# Altium project BerndoKeyboard-Switchboard.PrjPcb (part 2 of 4)

## Sheet [03] - Keyboard Matrix 1.SchDoc: Keyboard Matrix 1
size A3; Date: N.A.; ApprovedBy: N.A.; CheckedBy: N.A.; Author: N.A.; CompanyName: Johannes Berndorfer; DrawnBy: JBE; Organization: N.A.; Address1: Konrad Grefe Gasse 22; Address2: 1230 Wien; Address3: AUSTRIA; Address4: N.A.; DocumentNumber: 3; Revision: A; SheetNumber: 3; SheetTotal: 8; ProjectTitle: Berndo Keyboard Switchboard PCB; Reviewer: -; Time: N.A.; ImagePath: N.A.; Application_BuildNumber: N.A.
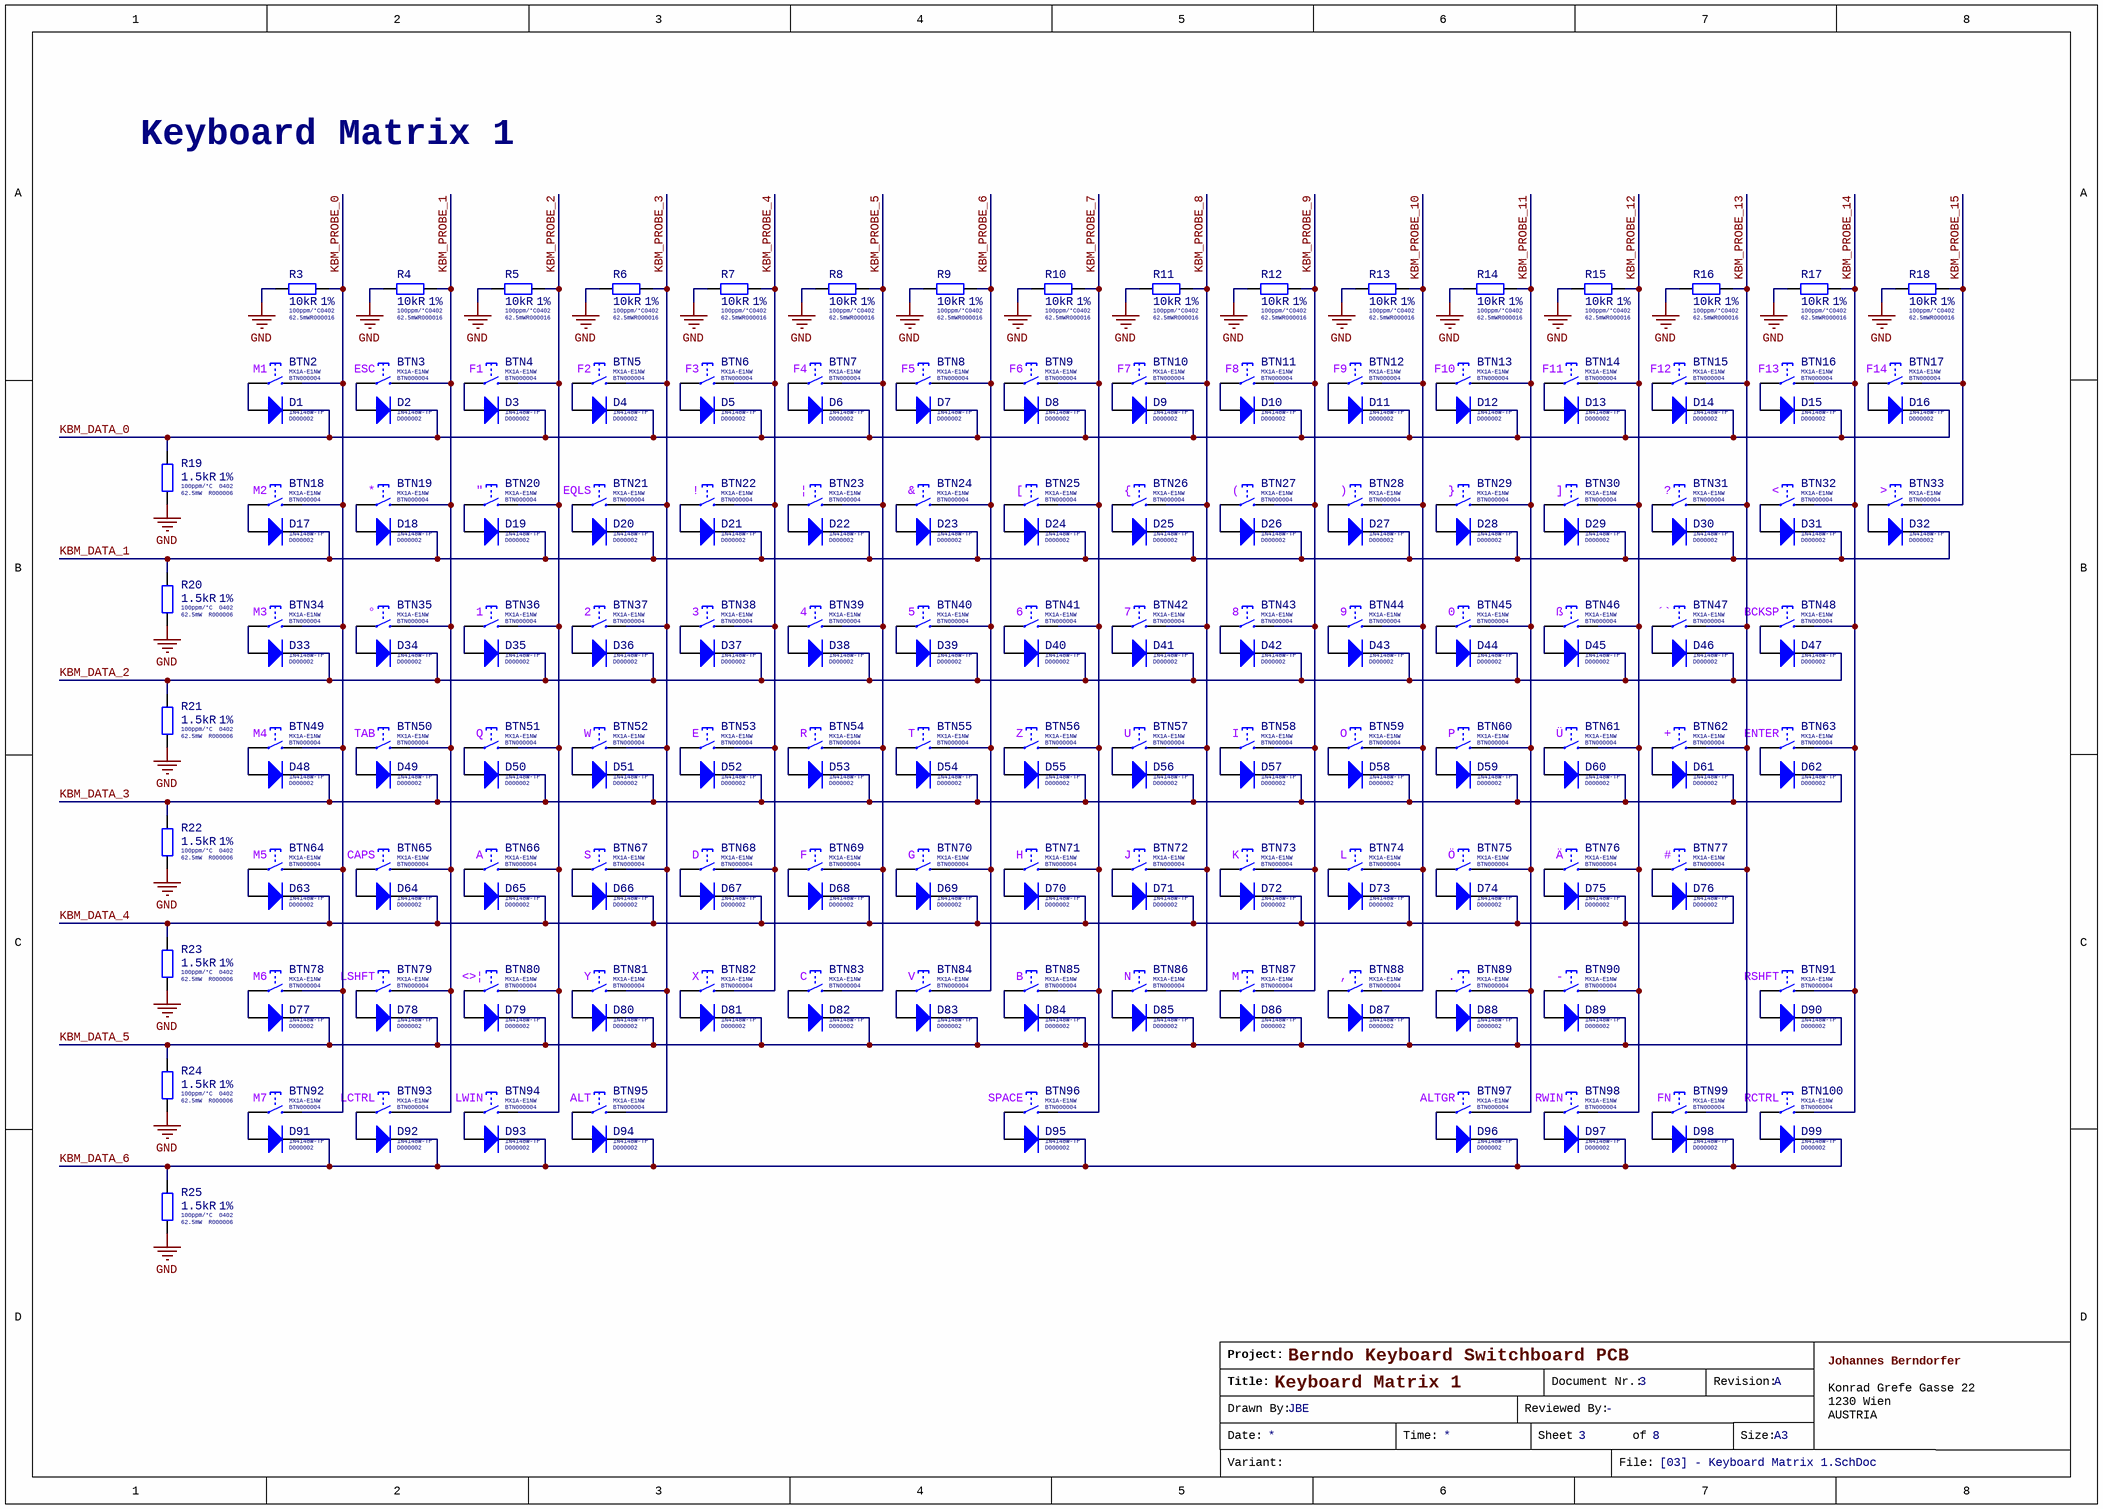
[diagram p2: [03] - Keyboard Matrix 1.SchDoc]

### Parts
BTN2  MX1A-E1NW  Internal Part Number: BTN000004  Key Function: M1  [BTN-THT-MX-CHERRY]
BTN3  MX1A-E1NW  Internal Part Number: BTN000004  Key Function: ESC  [BTN-THT-MX-CHERRY]
BTN4  MX1A-E1NW  Internal Part Number: BTN000004  Key Function: F1  [BTN-THT-MX-CHERRY]
BTN5  MX1A-E1NW  Internal Part Number: BTN000004  Key Function: F2  [BTN-THT-MX-CHERRY]
BTN6  MX1A-E1NW  Internal Part Number: BTN000004  Key Function: F3  [BTN-THT-MX-CHERRY]
BTN7  MX1A-E1NW  Internal Part Number: BTN000004  Key Function: F4  [BTN-THT-MX-CHERRY]
BTN8  MX1A-E1NW  Internal Part Number: BTN000004  Key Function: F5  [BTN-THT-MX-CHERRY]
BTN9  MX1A-E1NW  Internal Part Number: BTN000004  Key Function: F6  [BTN-THT-MX-CHERRY]
BTN10  MX1A-E1NW  Internal Part Number: BTN000004  Key Function: F7  [BTN-THT-MX-CHERRY]
BTN11  MX1A-E1NW  Internal Part Number: BTN000004  Key Function: F8  [BTN-THT-MX-CHERRY]
BTN12  MX1A-E1NW  Internal Part Number: BTN000004  Key Function: F9  [BTN-THT-MX-CHERRY]
BTN13  MX1A-E1NW  Internal Part Number: BTN000004  Key Function: F10  [BTN-THT-MX-CHERRY]
BTN14  MX1A-E1NW  Internal Part Number: BTN000004  Key Function: F11  [BTN-THT-MX-CHERRY]
BTN15  MX1A-E1NW  Internal Part Number: BTN000004  Key Function: F12  [BTN-THT-MX-CHERRY]
BTN16  MX1A-E1NW  Internal Part Number: BTN000004  Key Function: F13  [BTN-THT-MX-CHERRY]
BTN17  MX1A-E1NW  Internal Part Number: BTN000004  Key Function: F14  [BTN-THT-MX-CHERRY]
BTN18  MX1A-E1NW  Internal Part Number: BTN000004  Key Function: M2  [BTN-THT-MX-CHERRY]
BTN19  MX1A-E1NW  Internal Part Number: BTN000004  [BTN-THT-MX-CHERRY]
BTN20  MX1A-E1NW  Internal Part Number: BTN000004  Key Function: "  [BTN-THT-MX-CHERRY]
BTN21  MX1A-E1NW  Internal Part Number: BTN000004  Key Function: EQLS  [BTN-THT-MX-CHERRY]
BTN22  MX1A-E1NW  Internal Part Number: BTN000004  Key Function: !  [BTN-THT-MX-CHERRY]
BTN23  MX1A-E1NW  Internal Part Number: BTN000004  Key Function: |  [BTN-THT-MX-CHERRY]
BTN24  MX1A-E1NW  Internal Part Number: BTN000004  Key Function: &  [BTN-THT-MX-CHERRY]
BTN25  MX1A-E1NW  Internal Part Number: BTN000004  Key Function: [  [BTN-THT-MX-CHERRY]
BTN26  MX1A-E1NW  Internal Part Number: BTN000004  Key Function: {  [BTN-THT-MX-CHERRY]
BTN27  MX1A-E1NW  Internal Part Number: BTN000004  Key Function: (  [BTN-THT-MX-CHERRY]
BTN28  MX1A-E1NW  Internal Part Number: BTN000004  Key Function: )  [BTN-THT-MX-CHERRY]
BTN29  MX1A-E1NW  Internal Part Number: BTN000004  Key Function: }  [BTN-THT-MX-CHERRY]
BTN30  MX1A-E1NW  Internal Part Number: BTN000004  Key Function: ]  [BTN-THT-MX-CHERRY]
BTN31  MX1A-E1NW  Internal Part Number: BTN000004  [BTN-THT-MX-CHERRY]
BTN32  MX1A-E1NW  Internal Part Number: BTN000004  Key Function: <  [BTN-THT-MX-CHERRY]
BTN33  MX1A-E1NW  Internal Part Number: BTN000004  Key Function: >  [BTN-THT-MX-CHERRY]
BTN34  MX1A-E1NW  Internal Part Number: BTN000004  Key Function: M3  [BTN-THT-MX-CHERRY]
BTN35  MX1A-E1NW  Internal Part Number: BTN000004  Key Function: °  [BTN-THT-MX-CHERRY]
BTN36  MX1A-E1NW  Internal Part Number: BTN000004  Key Function: 1  [BTN-THT-MX-CHERRY]
BTN37  MX1A-E1NW  Internal Part Number: BTN000004  Key Function: 2  [BTN-THT-MX-CHERRY]
BTN38  MX1A-E1NW  Internal Part Number: BTN000004  Key Function: 3  [BTN-THT-MX-CHERRY]
BTN39  MX1A-E1NW  Internal Part Number: BTN000004  Key Function: 4  [BTN-THT-MX-CHERRY]
BTN40  MX1A-E1NW  Internal Part Number: BTN000004  Key Function: 5  [BTN-THT-MX-CHERRY]
BTN41  MX1A-E1NW  Internal Part Number: BTN000004  Key Function: 6  [BTN-THT-MX-CHERRY]
BTN42  MX1A-E1NW  Internal Part Number: BTN000004  Key Function: 7  [BTN-THT-MX-CHERRY]
BTN43  MX1A-E1NW  Internal Part Number: BTN000004  Key Function: 8  [BTN-THT-MX-CHERRY]
BTN44  MX1A-E1NW  Internal Part Number: BTN000004  Key Function: 9  [BTN-THT-MX-CHERRY]
BTN45  MX1A-E1NW  Internal Part Number: BTN000004  Key Function: 0  [BTN-THT-MX-CHERRY]
BTN46  MX1A-E1NW  Internal Part Number: BTN000004  Key Function: ß  [BTN-THT-MX-CHERRY]
BTN47  MX1A-E1NW  Internal Part Number: BTN000004  Key Function: ´`  [BTN-THT-MX-CHERRY]
BTN48  MX1A-E1NW  Internal Part Number: BTN000004  Key Function: BCKSP  [BTN-THT-MX-CHERRY]
BTN49  MX1A-E1NW  Internal Part Number: BTN000004  Key Function: M4  [BTN-THT-MX-CHERRY]
BTN50  MX1A-E1NW  Internal Part Number: BTN000004  Key Function: TAB  [BTN-THT-MX-CHERRY]
BTN51  MX1A-E1NW  Internal Part Number: BTN000004  Key Function: Q  [BTN-THT-MX-CHERRY]
BTN52  MX1A-E1NW  Internal Part Number: BTN000004  Key Function: W  [BTN-THT-MX-CHERRY]
BTN53  MX1A-E1NW  Internal Part Number: BTN000004  Key Function: E  [BTN-THT-MX-CHERRY]
BTN54  MX1A-E1NW  Internal Part Number: BTN000004  Key Function: R  [BTN-THT-MX-CHERRY]
BTN55  MX1A-E1NW  Internal Part Number: BTN000004  Key Function: T  [BTN-THT-MX-CHERRY]
BTN56  MX1A-E1NW  Internal Part Number: BTN000004  Key Function: Z  [BTN-THT-MX-CHERRY]
BTN57  MX1A-E1NW  Internal Part Number: BTN000004  Key Function: U  [BTN-THT-MX-CHERRY]
BTN58  MX1A-E1NW  Internal Part Number: BTN000004  Key Function: I  [BTN-THT-MX-CHERRY]
BTN59  MX1A-E1NW  Internal Part Number: BTN000004  Key Function: O  [BTN-THT-MX-CHERRY]
BTN60  MX1A-E1NW  Internal Part Number: BTN000004  Key Function: P  [BTN-THT-MX-CHERRY]
BTN61  MX1A-E1NW  Internal Part Number: BTN000004  Key Function: Ü  [BTN-THT-MX-CHERRY]
BTN62  MX1A-E1NW  Internal Part Number: BTN000004  Key Function: +  [BTN-THT-MX-CHERRY]
BTN63  MX1A-E1NW  Internal Part Number: BTN000004  Key Function: ENTER  [BTN-THT-MX-CHERRY]
BTN64  MX1A-E1NW  Internal Part Number: BTN000004  Key Function: M5  [BTN-THT-MX-CHERRY]
BTN65  MX1A-E1NW  Internal Part Number: BTN000004  Key Function: CAPS  [BTN-THT-MX-CHERRY]
BTN66  MX1A-E1NW  Internal Part Number: BTN000004  Key Function: A  [BTN-THT-MX-CHERRY]
BTN67  MX1A-E1NW  Internal Part Number: BTN000004  Key Function: S  [BTN-THT-MX-CHERRY]
BTN68  MX1A-E1NW  Internal Part Number: BTN000004  Key Function: D  [BTN-THT-MX-CHERRY]
BTN69  MX1A-E1NW  Internal Part Number: BTN000004  Key Function: F  [BTN-THT-MX-CHERRY]
BTN70  MX1A-E1NW  Internal Part Number: BTN000004  Key Function: G  [BTN-THT-MX-CHERRY]
BTN71  MX1A-E1NW  Internal Part Number: BTN000004  Key Function: H  [BTN-THT-MX-CHERRY]
BTN72  MX1A-E1NW  Internal Part Number: BTN000004  Key Function: J  [BTN-THT-MX-CHERRY]
BTN73  MX1A-E1NW  Internal Part Number: BTN000004  Key Function: K  [BTN-THT-MX-CHERRY]
BTN74  MX1A-E1NW  Internal Part Number: BTN000004  Key Function: L  [BTN-THT-MX-CHERRY]
BTN75  MX1A-E1NW  Internal Part Number: BTN000004  Key Function: Ö  [BTN-THT-MX-CHERRY]
BTN76  MX1A-E1NW  Internal Part Number: BTN000004  Key Function: Ä  [BTN-THT-MX-CHERRY]
BTN77  MX1A-E1NW  Internal Part Number: BTN000004  Key Function: #  [BTN-THT-MX-CHERRY]
BTN78  MX1A-E1NW  Internal Part Number: BTN000004  Key Function: M6  [BTN-THT-MX-CHERRY]
BTN79  MX1A-E1NW  Internal Part Number: BTN000004  Key Function: LSHFT  [BTN-THT-MX-CHERRY]
BTN80  MX1A-E1NW  Internal Part Number: BTN000004  Key Function: <>|  [BTN-THT-MX-CHERRY]
BTN81  MX1A-E1NW  Internal Part Number: BTN000004  Key Function: Y  [BTN-THT-MX-CHERRY]
BTN82  MX1A-E1NW  Internal Part Number: BTN000004  Key Function: X  [BTN-THT-MX-CHERRY]
BTN83  MX1A-E1NW  Internal Part Number: BTN000004  Key Function: C  [BTN-THT-MX-CHERRY]
BTN84  MX1A-E1NW  Internal Part Number: BTN000004  Key Function: V  [BTN-THT-MX-CHERRY]
BTN85  MX1A-E1NW  Internal Part Number: BTN000004  Key Function: B  [BTN-THT-MX-CHERRY]
BTN86  MX1A-E1NW  Internal Part Number: BTN000004  Key Function: N  [BTN-THT-MX-CHERRY]
BTN87  MX1A-E1NW  Internal Part Number: BTN000004  Key Function: M  [BTN-THT-MX-CHERRY]
BTN88  MX1A-E1NW  Internal Part Number: BTN000004  Key Function: ,  [BTN-THT-MX-CHERRY]
BTN89  MX1A-E1NW  Internal Part Number: BTN000004  Key Function: .  [BTN-THT-MX-CHERRY]
BTN90  MX1A-E1NW  Internal Part Number: BTN000004  [BTN-THT-MX-CHERRY]
BTN91  MX1A-E1NW  Internal Part Number: BTN000004  Key Function: RSHFT  [BTN-THT-MX-CHERRY]
BTN92  MX1A-E1NW  Internal Part Number: BTN000004  Key Function: M7  [BTN-THT-MX-CHERRY]
BTN93  MX1A-E1NW  Internal Part Number: BTN000004  Key Function: LCTRL  [BTN-THT-MX-CHERRY]
BTN94  MX1A-E1NW  Internal Part Number: BTN000004  Key Function: LWIN  [BTN-THT-MX-CHERRY]
BTN95  MX1A-E1NW  Internal Part Number: BTN000004  Key Function: ALT  [BTN-THT-MX-CHERRY]
BTN96  MX1A-E1NW  Internal Part Number: BTN000004  Key Function: SPACE  [BTN-THT-MX-CHERRY]
BTN97  MX1A-E1NW  Internal Part Number: BTN000004  Key Function: ALTGR  [BTN-THT-MX-CHERRY]
BTN98  MX1A-E1NW  Internal Part Number: BTN000004  Key Function: RWIN  [BTN-THT-MX-CHERRY]
BTN99  MX1A-E1NW  Internal Part Number: BTN000004  Key Function: FN  [BTN-THT-MX-CHERRY]
BTN100  MX1A-E1NW  Internal Part Number: BTN000004  Key Function: RCTRL  [BTN-THT-MX-CHERRY]
D1  1N4148W-TP  Internal Part Number: D000002  [D-SMD-SOD-123-MICRO-COMMERCIAL-COMPONENTS]
D2  1N4148W-TP  Internal Part Number: D000002  [D-SMD-SOD-123-MICRO-COMMERCIAL-COMPONENTS]
D3  1N4148W-TP  Internal Part Number: D000002  [D-SMD-SOD-123-MICRO-COMMERCIAL-COMPONENTS]
D4  1N4148W-TP  Internal Part Number: D000002  [D-SMD-SOD-123-MICRO-COMMERCIAL-COMPONENTS]
D5  1N4148W-TP  Internal Part Number: D000002  [D-SMD-SOD-123-MICRO-COMMERCIAL-COMPONENTS]
D6  1N4148W-TP  Internal Part Number: D000002  [D-SMD-SOD-123-MICRO-COMMERCIAL-COMPONENTS]
D7  1N4148W-TP  Internal Part Number: D000002  [D-SMD-SOD-123-MICRO-COMMERCIAL-COMPONENTS]
D8  1N4148W-TP  Internal Part Number: D000002  [D-SMD-SOD-123-MICRO-COMMERCIAL-COMPONENTS]
D9  1N4148W-TP  Internal Part Number: D000002  [D-SMD-SOD-123-MICRO-COMMERCIAL-COMPONENTS]
D10  1N4148W-TP  Internal Part Number: D000002  [D-SMD-SOD-123-MICRO-COMMERCIAL-COMPONENTS]
D11  1N4148W-TP  Internal Part Number: D000002  [D-SMD-SOD-123-MICRO-COMMERCIAL-COMPONENTS]
D12  1N4148W-TP  Internal Part Number: D000002  [D-SMD-SOD-123-MICRO-COMMERCIAL-COMPONENTS]
D13  1N4148W-TP  Internal Part Number: D000002  [D-SMD-SOD-123-MICRO-COMMERCIAL-COMPONENTS]
D14  1N4148W-TP  Internal Part Number: D000002  [D-SMD-SOD-123-MICRO-COMMERCIAL-COMPONENTS]
D15  1N4148W-TP  Internal Part Number: D000002  [D-SMD-SOD-123-MICRO-COMMERCIAL-COMPONENTS]
D16  1N4148W-TP  Internal Part Number: D000002  [D-SMD-SOD-123-MICRO-COMMERCIAL-COMPONENTS]
D17  1N4148W-TP  Internal Part Number: D000002  [D-SMD-SOD-123-MICRO-COMMERCIAL-COMPONENTS]
D18  1N4148W-TP  Internal Part Number: D000002  [D-SMD-SOD-123-MICRO-COMMERCIAL-COMPONENTS]
D19  1N4148W-TP  Internal Part Number: D000002  [D-SMD-SOD-123-MICRO-COMMERCIAL-COMPONENTS]
D20  1N4148W-TP  Internal Part Number: D000002  [D-SMD-SOD-123-MICRO-COMMERCIAL-COMPONENTS]
D21  1N4148W-TP  Internal Part Number: D000002  [D-SMD-SOD-123-MICRO-COMMERCIAL-COMPONENTS]
D22  1N4148W-TP  Internal Part Number: D000002  [D-SMD-SOD-123-MICRO-COMMERCIAL-COMPONENTS]
D23  1N4148W-TP  Internal Part Number: D000002  [D-SMD-SOD-123-MICRO-COMMERCIAL-COMPONENTS]
D24  1N4148W-TP  Internal Part Number: D000002  [D-SMD-SOD-123-MICRO-COMMERCIAL-COMPONENTS]
D25  1N4148W-TP  Internal Part Number: D000002  [D-SMD-SOD-123-MICRO-COMMERCIAL-COMPONENTS]
D26  1N4148W-TP  Internal Part Number: D000002  [D-SMD-SOD-123-MICRO-COMMERCIAL-COMPONENTS]
D27  1N4148W-TP  Internal Part Number: D000002  [D-SMD-SOD-123-MICRO-COMMERCIAL-COMPONENTS]
D28  1N4148W-TP  Internal Part Number: D000002  [D-SMD-SOD-123-MICRO-COMMERCIAL-COMPONENTS]
D29  1N4148W-TP  Internal Part Number: D000002  [D-SMD-SOD-123-MICRO-COMMERCIAL-COMPONENTS]
D30  1N4148W-TP  Internal Part Number: D000002  [D-SMD-SOD-123-MICRO-COMMERCIAL-COMPONENTS]
D31  1N4148W-TP  Internal Part Number: D000002  [D-SMD-SOD-123-MICRO-COMMERCIAL-COMPONENTS]
D32  1N4148W-TP  Internal Part Number: D000002  [D-SMD-SOD-123-MICRO-COMMERCIAL-COMPONENTS]
D33  1N4148W-TP  Internal Part Number: D000002  [D-SMD-SOD-123-MICRO-COMMERCIAL-COMPONENTS]
D34  1N4148W-TP  Internal Part Number: D000002  [D-SMD-SOD-123-MICRO-COMMERCIAL-COMPONENTS]
D35  1N4148W-TP  Internal Part Number: D000002  [D-SMD-SOD-123-MICRO-COMMERCIAL-COMPONENTS]
D36  1N4148W-TP  Internal Part Number: D000002  [D-SMD-SOD-123-MICRO-COMMERCIAL-COMPONENTS]
D37  1N4148W-TP  Internal Part Number: D000002  [D-SMD-SOD-123-MICRO-COMMERCIAL-COMPONENTS]
D38  1N4148W-TP  Internal Part Number: D000002  [D-SMD-SOD-123-MICRO-COMMERCIAL-COMPONENTS]
D39  1N4148W-TP  Internal Part Number: D000002  [D-SMD-SOD-123-MICRO-COMMERCIAL-COMPONENTS]
D40  1N4148W-TP  Internal Part Number: D000002  [D-SMD-SOD-123-MICRO-COMMERCIAL-COMPONENTS]
D41  1N4148W-TP  Internal Part Number: D000002  [D-SMD-SOD-123-MICRO-COMMERCIAL-COMPONENTS]
D42  1N4148W-TP  Internal Part Number: D000002  [D-SMD-SOD-123-MICRO-COMMERCIAL-COMPONENTS]
D43  1N4148W-TP  Internal Part Number: D000002  [D-SMD-SOD-123-MICRO-COMMERCIAL-COMPONENTS]
D44  1N4148W-TP  Internal Part Number: D000002  [D-SMD-SOD-123-MICRO-COMMERCIAL-COMPONENTS]
D45  1N4148W-TP  Internal Part Number: D000002  [D-SMD-SOD-123-MICRO-COMMERCIAL-COMPONENTS]
D46  1N4148W-TP  Internal Part Number: D000002  [D-SMD-SOD-123-MICRO-COMMERCIAL-COMPONENTS]
D47  1N4148W-TP  Internal Part Number: D000002  [D-SMD-SOD-123-MICRO-COMMERCIAL-COMPONENTS]
D48  1N4148W-TP  Internal Part Number: D000002  [D-SMD-SOD-123-MICRO-COMMERCIAL-COMPONENTS]
D49  1N4148W-TP  Internal Part Number: D000002  [D-SMD-SOD-123-MICRO-COMMERCIAL-COMPONENTS]
D50  1N4148W-TP  Internal Part Number: D000002  [D-SMD-SOD-123-MICRO-COMMERCIAL-COMPONENTS]
D51  1N4148W-TP  Internal Part Number: D000002  [D-SMD-SOD-123-MICRO-COMMERCIAL-COMPONENTS]
D52  1N4148W-TP  Internal Part Number: D000002  [D-SMD-SOD-123-MICRO-COMMERCIAL-COMPONENTS]
D53  1N4148W-TP  Internal Part Number: D000002  [D-SMD-SOD-123-MICRO-COMMERCIAL-COMPONENTS]
D54  1N4148W-TP  Internal Part Number: D000002  [D-SMD-SOD-123-MICRO-COMMERCIAL-COMPONENTS]
D55  1N4148W-TP  Internal Part Number: D000002  [D-SMD-SOD-123-MICRO-COMMERCIAL-COMPONENTS]
D56  1N4148W-TP  Internal Part Number: D000002  [D-SMD-SOD-123-MICRO-COMMERCIAL-COMPONENTS]
D57  1N4148W-TP  Internal Part Number: D000002  [D-SMD-SOD-123-MICRO-COMMERCIAL-COMPONENTS]
D58  1N4148W-TP  Internal Part Number: D000002  [D-SMD-SOD-123-MICRO-COMMERCIAL-COMPONENTS]
D59  1N4148W-TP  Internal Part Number: D000002  [D-SMD-SOD-123-MICRO-COMMERCIAL-COMPONENTS]
D60  1N4148W-TP  Internal Part Number: D000002  [D-SMD-SOD-123-MICRO-COMMERCIAL-COMPONENTS]
D61  1N4148W-TP  Internal Part Number: D000002  [D-SMD-SOD-123-MICRO-COMMERCIAL-COMPONENTS]
D62  1N4148W-TP  Internal Part Number: D000002  [D-SMD-SOD-123-MICRO-COMMERCIAL-COMPONENTS]
D63  1N4148W-TP  Internal Part Number: D000002  [D-SMD-SOD-123-MICRO-COMMERCIAL-COMPONENTS]
D64  1N4148W-TP  Internal Part Number: D000002  [D-SMD-SOD-123-MICRO-COMMERCIAL-COMPONENTS]
D65  1N4148W-TP  Internal Part Number: D000002  [D-SMD-SOD-123-MICRO-COMMERCIAL-COMPONENTS]
D66  1N4148W-TP  Internal Part Number: D000002  [D-SMD-SOD-123-MICRO-COMMERCIAL-COMPONENTS]
D67  1N4148W-TP  Internal Part Number: D000002  [D-SMD-SOD-123-MICRO-COMMERCIAL-COMPONENTS]
D68  1N4148W-TP  Internal Part Number: D000002  [D-SMD-SOD-123-MICRO-COMMERCIAL-COMPONENTS]
D69  1N4148W-TP  Internal Part Number: D000002  [D-SMD-SOD-123-MICRO-COMMERCIAL-COMPONENTS]
D70  1N4148W-TP  Internal Part Number: D000002  [D-SMD-SOD-123-MICRO-COMMERCIAL-COMPONENTS]
D71  1N4148W-TP  Internal Part Number: D000002  [D-SMD-SOD-123-MICRO-COMMERCIAL-COMPONENTS]
D72  1N4148W-TP  Internal Part Number: D000002  [D-SMD-SOD-123-MICRO-COMMERCIAL-COMPONENTS]
D73  1N4148W-TP  Internal Part Number: D000002  [D-SMD-SOD-123-MICRO-COMMERCIAL-COMPONENTS]
D74  1N4148W-TP  Internal Part Number: D000002  [D-SMD-SOD-123-MICRO-COMMERCIAL-COMPONENTS]
D75  1N4148W-TP  Internal Part Number: D000002  [D-SMD-SOD-123-MICRO-COMMERCIAL-COMPONENTS]
D76  1N4148W-TP  Internal Part Number: D000002  [D-SMD-SOD-123-MICRO-COMMERCIAL-COMPONENTS]
D77  1N4148W-TP  Internal Part Number: D000002  [D-SMD-SOD-123-MICRO-COMMERCIAL-COMPONENTS]
D78  1N4148W-TP  Internal Part Number: D000002  [D-SMD-SOD-123-MICRO-COMMERCIAL-COMPONENTS]
D79  1N4148W-TP  Internal Part Number: D000002  [D-SMD-SOD-123-MICRO-COMMERCIAL-COMPONENTS]
D80  1N4148W-TP  Internal Part Number: D000002  [D-SMD-SOD-123-MICRO-COMMERCIAL-COMPONENTS]
D81  1N4148W-TP  Internal Part Number: D000002  [D-SMD-SOD-123-MICRO-COMMERCIAL-COMPONENTS]
D82  1N4148W-TP  Internal Part Number: D000002  [D-SMD-SOD-123-MICRO-COMMERCIAL-COMPONENTS]
D83  1N4148W-TP  Internal Part Number: D000002  [D-SMD-SOD-123-MICRO-COMMERCIAL-COMPONENTS]
D84  1N4148W-TP  Internal Part Number: D000002  [D-SMD-SOD-123-MICRO-COMMERCIAL-COMPONENTS]
D85  1N4148W-TP  Internal Part Number: D000002  [D-SMD-SOD-123-MICRO-COMMERCIAL-COMPONENTS]
D86  1N4148W-TP  Internal Part Number: D000002  [D-SMD-SOD-123-MICRO-COMMERCIAL-COMPONENTS]
D87  1N4148W-TP  Internal Part Number: D000002  [D-SMD-SOD-123-MICRO-COMMERCIAL-COMPONENTS]
D88  1N4148W-TP  Internal Part Number: D000002  [D-SMD-SOD-123-MICRO-COMMERCIAL-COMPONENTS]
D89  1N4148W-TP  Internal Part Number: D000002  [D-SMD-SOD-123-MICRO-COMMERCIAL-COMPONENTS]
D90  1N4148W-TP  Internal Part Number: D000002  [D-SMD-SOD-123-MICRO-COMMERCIAL-COMPONENTS]
D91  1N4148W-TP  Internal Part Number: D000002  [D-SMD-SOD-123-MICRO-COMMERCIAL-COMPONENTS]
D92  1N4148W-TP  Internal Part Number: D000002  [D-SMD-SOD-123-MICRO-COMMERCIAL-COMPONENTS]
D93  1N4148W-TP  Internal Part Number: D000002  [D-SMD-SOD-123-MICRO-COMMERCIAL-COMPONENTS]
D94  1N4148W-TP  Internal Part Number: D000002  [D-SMD-SOD-123-MICRO-COMMERCIAL-COMPONENTS]
D95  1N4148W-TP  Internal Part Number: D000002  [D-SMD-SOD-123-MICRO-COMMERCIAL-COMPONENTS]
D96  1N4148W-TP  Internal Part Number: D000002  [D-SMD-SOD-123-MICRO-COMMERCIAL-COMPONENTS]
D97  1N4148W-TP  Internal Part Number: D000002  [D-SMD-SOD-123-MICRO-COMMERCIAL-COMPONENTS]
D98  1N4148W-TP  Internal Part Number: D000002  [D-SMD-SOD-123-MICRO-COMMERCIAL-COMPONENTS]
D99  1N4148W-TP  Internal Part Number: D000002  [D-SMD-SOD-123-MICRO-COMMERCIAL-COMPONENTS]
R3  Tolerance: 1%  Temperature Coefficient: 100ppm/°C  Resistance: 10kR  Power Rating: 62.5mW  Case Code (Imperial): 0402  Internal Part Number: R000016  [RES-SMD-0402-0.4MM-IPC-MED]  (hidden comment: 10kR 1%)
R4  Tolerance: 1%  Temperature Coefficient: 100ppm/°C  Resistance: 10kR  Power Rating: 62.5mW  Case Code (Imperial): 0402  Internal Part Number: R000016  [RES-SMD-0402-0.4MM-IPC-MED]  (hidden comment: 10kR 1%)
R5  Tolerance: 1%  Temperature Coefficient: 100ppm/°C  Resistance: 10kR  Power Rating: 62.5mW  Case Code (Imperial): 0402  Internal Part Number: R000016  [RES-SMD-0402-0.4MM-IPC-MED]  (hidden comment: 10kR 1%)
R6  Tolerance: 1%  Temperature Coefficient: 100ppm/°C  Resistance: 10kR  Power Rating: 62.5mW  Case Code (Imperial): 0402  Internal Part Number: R000016  [RES-SMD-0402-0.4MM-IPC-MED]  (hidden comment: 10kR 1%)
R7  Tolerance: 1%  Temperature Coefficient: 100ppm/°C  Resistance: 10kR  Power Rating: 62.5mW  Case Code (Imperial): 0402  Internal Part Number: R000016  [RES-SMD-0402-0.4MM-IPC-MED]  (hidden comment: 10kR 1%)
R8  Tolerance: 1%  Temperature Coefficient: 100ppm/°C  Resistance: 10kR  Power Rating: 62.5mW  Case Code (Imperial): 0402  Internal Part Number: R000016  [RES-SMD-0402-0.4MM-IPC-MED]  (hidden comment: 10kR 1%)
R9  Tolerance: 1%  Temperature Coefficient: 100ppm/°C  Resistance: 10kR  Power Rating: 62.5mW  Case Code (Imperial): 0402  Internal Part Number: R000016  [RES-SMD-0402-0.4MM-IPC-MED]  (hidden comment: 10kR 1%)
R10  Tolerance: 1%  Temperature Coefficient: 100ppm/°C  Resistance: 10kR  Power Rating: 62.5mW  Case Code (Imperial): 0402  Internal Part Number: R000016  [RES-SMD-0402-0.4MM-IPC-MED]  (hidden comment: 10kR 1%)
R11  Tolerance: 1%  Temperature Coefficient: 100ppm/°C  Resistance: 10kR  Power Rating: 62.5mW  Case Code (Imperial): 0402  Internal Part Number: R000016  [RES-SMD-0402-0.4MM-IPC-MED]  (hidden comment: 10kR 1%)
R12  Tolerance: 1%  Temperature Coefficient: 100ppm/°C  Resistance: 10kR  Power Rating: 62.5mW  Case Code (Imperial): 0402  Internal Part Number: R000016  [RES-SMD-0402-0.4MM-IPC-MED]  (hidden comment: 10kR 1%)
R13  Tolerance: 1%  Temperature Coefficient: 100ppm/°C  Resistance: 10kR  Power Rating: 62.5mW  Case Code (Imperial): 0402  Internal Part Number: R000016  [RES-SMD-0402-0.4MM-IPC-MED]  (hidden comment: 10kR 1%)
R14  Tolerance: 1%  Temperature Coefficient: 100ppm/°C  Resistance: 10kR  Power Rating: 62.5mW  Case Code (Imperial): 0402  Internal Part Number: R000016  [RES-SMD-0402-0.4MM-IPC-MED]  (hidden comment: 10kR 1%)
R15  Tolerance: 1%  Temperature Coefficient: 100ppm/°C  Resistance: 10kR  Power Rating: 62.5mW  Case Code (Imperial): 0402  Internal Part Number: R000016  [RES-SMD-0402-0.4MM-IPC-MED]  (hidden comment: 10kR 1%)
R16  Tolerance: 1%  Temperature Coefficient: 100ppm/°C  Resistance: 10kR  Power Rating: 62.5mW  Case Code (Imperial): 0402  Internal Part Number: R000016  [RES-SMD-0402-0.4MM-IPC-MED]  (hidden comment: 10kR 1%)
R17  Tolerance: 1%  Temperature Coefficient: 100ppm/°C  Resistance: 10kR  Power Rating: 62.5mW  Case Code (Imperial): 0402  Internal Part Number: R000016  [RES-SMD-0402-0.4MM-IPC-MED]  (hidden comment: 10kR 1%)
R18  Tolerance: 1%  Temperature Coefficient: 100ppm/°C  Resistance: 10kR  Power Rating: 62.5mW  Case Code (Imperial): 0402  Internal Part Number: R000016  [RES-SMD-0402-0.4MM-IPC-MED]  (hidden comment: 10kR 1%)
R19  Temperature Coefficient: 100ppm/°C  Tolerance: 1%  Resistance: 1.5kR  Max Power Dissipation: 62.5mW  Case/Package: 0402  Internal Part Number: R000006  [RES-SMD-0402-0.4MM-IPC-MED]  (hidden comment: 1.5kR 1%)
R20  Temperature Coefficient: 100ppm/°C  Tolerance: 1%  Resistance: 1.5kR  Max Power Dissipation: 62.5mW  Case/Package: 0402  Internal Part Number: R000006  [RES-SMD-0402-0.4MM-IPC-MED]  (hidden comment: 1.5kR 1%)
R21  Temperature Coefficient: 100ppm/°C  Tolerance: 1%  Resistance: 1.5kR  Max Power Dissipation: 62.5mW  Case/Package: 0402  Internal Part Number: R000006  [RES-SMD-0402-0.4MM-IPC-MED]  (hidden comment: 1.5kR 1%)
R22  Temperature Coefficient: 100ppm/°C  Tolerance: 1%  Resistance: 1.5kR  Max Power Dissipation: 62.5mW  Case/Package: 0402  Internal Part Number: R000006  [RES-SMD-0402-0.4MM-IPC-MED]  (hidden comment: 1.5kR 1%)
R23  Temperature Coefficient: 100ppm/°C  Tolerance: 1%  Resistance: 1.5kR  Max Power Dissipation: 62.5mW  Case/Package: 0402  Internal Part Number: R000006  [RES-SMD-0402-0.4MM-IPC-MED]  (hidden comment: 1.5kR 1%)
R24  Temperature Coefficient: 100ppm/°C  Tolerance: 1%  Resistance: 1.5kR  Max Power Dissipation: 62.5mW  Case/Package: 0402  Internal Part Number: R000006  [RES-SMD-0402-0.4MM-IPC-MED]  (hidden comment: 1.5kR 1%)
R25  Temperature Coefficient: 100ppm/°C  Tolerance: 1%  Resistance: 1.5kR  Max Power Dissipation: 62.5mW  Case/Package: 0402  Internal Part Number: R000006  [RES-SMD-0402-0.4MM-IPC-MED]  (hidden comment: 1.5kR 1%)

### Nets
GND: R3.1 R4.1 R5.1 R6.1 R7.1 R8.1 R9.1 R10.1 R11.1 R12.1 R13.1 R14.1 R15.1 R16.1 R17.1 R18.1 R19.2 R20.2 R21.2 R22.2 R23.2 R24.2 R25.2
KBM_DATA_0: D1.1 D2.1 D3.1 D4.1 D5.1 D6.1 D7.1 D8.1 D9.1 D10.1 D11.1 D12.1 D13.1 D14.1 D15.1 D16.1 R19.1
KBM_DATA_1: D17.1 D18.1 D19.1 D20.1 D21.1 D22.1 D23.1 D24.1 D25.1 D26.1 D27.1 D28.1 D29.1 D30.1 D31.1 D32.1 R20.1
KBM_DATA_2: D33.1 D34.1 D35.1 D36.1 D37.1 D38.1 D39.1 D40.1 D41.1 D42.1 D43.1 D44.1 D45.1 D46.1 D47.1 R21.1
KBM_DATA_3: D48.1 D49.1 D50.1 D51.1 D52.1 D53.1 D54.1 D55.1 D56.1 D57.1 D58.1 D59.1 D60.1 D61.1 D62.1 R22.1
KBM_DATA_4: D63.1 D64.1 D65.1 D66.1 D67.1 D68.1 D69.1 D70.1 D71.1 D72.1 D73.1 D74.1 D75.1 D76.1 R23.1
KBM_DATA_5: D77.1 D78.1 D79.1 D80.1 D81.1 D82.1 D83.1 D84.1 D85.1 D86.1 D87.1 D88.1 D89.1 D90.1 R24.1
KBM_DATA_6: D91.1 D92.1 D93.1 D94.1 D95.1 D96.1 D97.1 D98.1 D99.1 R25.1
KBM_PROBE_0: BTN2.2 BTN18.2 BTN34.2 BTN49.2 BTN64.2 BTN78.2 BTN92.2 R3.2
KBM_PROBE_1: BTN3.2 BTN19.2 BTN35.2 BTN50.2 BTN65.2 BTN79.2 BTN93.2 R4.2
KBM_PROBE_2: BTN4.2 BTN20.2 BTN36.2 BTN51.2 BTN66.2 BTN80.2 BTN94.2 R5.2
KBM_PROBE_3: BTN5.2 BTN21.2 BTN37.2 BTN52.2 BTN67.2 BTN81.2 BTN95.2 R6.2
KBM_PROBE_4: BTN6.2 BTN22.2 BTN38.2 BTN53.2 BTN68.2 BTN82.2 R7.2
KBM_PROBE_5: BTN7.2 BTN23.2 BTN39.2 BTN54.2 BTN69.2 BTN83.2 R8.2
KBM_PROBE_6: BTN8.2 BTN24.2 BTN40.2 BTN55.2 BTN70.2 BTN84.2 R9.2
KBM_PROBE_7: BTN9.2 BTN25.2 BTN41.2 BTN56.2 BTN71.2 BTN85.2 BTN96.2 R10.2
KBM_PROBE_8: BTN10.2 BTN26.2 BTN42.2 BTN57.2 BTN72.2 BTN86.2 R11.2
KBM_PROBE_9: BTN11.2 BTN27.2 BTN43.2 BTN58.2 BTN73.2 BTN87.2 R12.2
KBM_PROBE_10: BTN12.2 BTN28.2 BTN44.2 BTN59.2 BTN74.2 BTN88.2 R13.2
KBM_PROBE_11: BTN13.2 BTN29.2 BTN45.2 BTN60.2 BTN75.2 BTN89.2 BTN97.2 R14.2
KBM_PROBE_12: BTN14.2 BTN30.2 BTN46.2 BTN61.2 BTN76.2 BTN90.2 BTN98.2 R15.2
KBM_PROBE_13: BTN15.2 BTN31.2 BTN47.2 BTN62.2 BTN77.2 BTN99.2 R16.2
KBM_PROBE_14: BTN16.2 BTN32.2 BTN48.2 BTN63.2 BTN91.2 BTN100.2 R17.2
KBM_PROBE_15: BTN17.2 BTN33.2 R18.2
NetBTN2_1: BTN2.1 D1.2
NetBTN3_1: BTN3.1 D2.2
NetBTN4_1: BTN4.1 D3.2
NetBTN5_1: BTN5.1 D4.2
NetBTN6_1: BTN6.1 D5.2
NetBTN7_1: BTN7.1 D6.2
NetBTN8_1: BTN8.1 D7.2
NetBTN9_1: BTN9.1 D8.2
NetBTN10_1: BTN10.1 D9.2
NetBTN11_1: BTN11.1 D10.2
NetBTN12_1: BTN12.1 D11.2
NetBTN13_1: BTN13.1 D12.2
NetBTN14_1: BTN14.1 D13.2
NetBTN15_1: BTN15.1 D14.2
NetBTN16_1: BTN16.1 D15.2
NetBTN17_1: BTN17.1 D16.2
NetBTN18_1: BTN18.1 D17.2
NetBTN19_1: BTN19.1 D18.2
NetBTN20_1: BTN20.1 D19.2
NetBTN21_1: BTN21.1 D20.2
NetBTN22_1: BTN22.1 D21.2
NetBTN23_1: BTN23.1 D22.2
NetBTN24_1: BTN24.1 D23.2
NetBTN25_1: BTN25.1 D24.2
NetBTN26_1: BTN26.1 D25.2
NetBTN27_1: BTN27.1 D26.2
NetBTN28_1: BTN28.1 D27.2
NetBTN29_1: BTN29.1 D28.2
NetBTN30_1: BTN30.1 D29.2
NetBTN31_1: BTN31.1 D30.2
NetBTN32_1: BTN32.1 D31.2
NetBTN33_1: BTN33.1 D32.2
NetBTN34_1: BTN34.1 D33.2
NetBTN35_1: BTN35.1 D34.2
NetBTN36_1: BTN36.1 D35.2
NetBTN37_1: BTN37.1 D36.2
NetBTN38_1: BTN38.1 D37.2
NetBTN39_1: BTN39.1 D38.2
NetBTN40_1: BTN40.1 D39.2
NetBTN41_1: BTN41.1 D40.2
NetBTN42_1: BTN42.1 D41.2
NetBTN43_1: BTN43.1 D42.2
NetBTN44_1: BTN44.1 D43.2
NetBTN45_1: BTN45.1 D44.2
NetBTN46_1: BTN46.1 D45.2
NetBTN47_1: BTN47.1 D46.2
NetBTN48_1: BTN48.1 D47.2
NetBTN49_1: BTN49.1 D48.2
NetBTN50_1: BTN50.1 D49.2
NetBTN51_1: BTN51.1 D50.2
NetBTN52_1: BTN52.1 D51.2
NetBTN53_1: BTN53.1 D52.2
NetBTN54_1: BTN54.1 D53.2
NetBTN55_1: BTN55.1 D54.2
NetBTN56_1: BTN56.1 D55.2
NetBTN57_1: BTN57.1 D56.2
NetBTN58_1: BTN58.1 D57.2
NetBTN59_1: BTN59.1 D58.2
NetBTN60_1: BTN60.1 D59.2
NetBTN61_1: BTN61.1 D60.2
NetBTN62_1: BTN62.1 D61.2
NetBTN63_1: BTN63.1 D62.2
NetBTN64_1: BTN64.1 D63.2
NetBTN65_1: BTN65.1 D64.2
NetBTN66_1: BTN66.1 D65.2
NetBTN67_1: BTN67.1 D66.2
NetBTN68_1: BTN68.1 D67.2
NetBTN69_1: BTN69.1 D68.2
NetBTN70_1: BTN70.1 D69.2
NetBTN71_1: BTN71.1 D70.2
NetBTN72_1: BTN72.1 D71.2
NetBTN73_1: BTN73.1 D72.2
NetBTN74_1: BTN74.1 D73.2
NetBTN75_1: BTN75.1 D74.2
NetBTN76_1: BTN76.1 D75.2
NetBTN77_1: BTN77.1 D76.2
NetBTN78_1: BTN78.1 D77.2
NetBTN79_1: BTN79.1 D78.2
NetBTN80_1: BTN80.1 D79.2
NetBTN81_1: BTN81.1 D80.2
NetBTN82_1: BTN82.1 D81.2
NetBTN83_1: BTN83.1 D82.2
NetBTN84_1: BTN84.1 D83.2
NetBTN85_1: BTN85.1 D84.2
NetBTN86_1: BTN86.1 D85.2
NetBTN87_1: BTN87.1 D86.2
NetBTN88_1: BTN88.1 D87.2
NetBTN89_1: BTN89.1 D88.2
NetBTN90_1: BTN90.1 D89.2
NetBTN91_1: BTN91.1 D90.2
NetBTN92_1: BTN92.1 D91.2
NetBTN93_1: BTN93.1 D92.2
NetBTN94_1: BTN94.1 D93.2
NetBTN95_1: BTN95.1 D94.2
NetBTN96_1: BTN96.1 D95.2
NetBTN97_1: BTN97.1 D96.2
NetBTN98_1: BTN98.1 D97.2
NetBTN99_1: BTN99.1 D98.2
NetBTN100_1: BTN100.1 D99.2

### Notes on the sheet
- Title:
- Project:
- Document Nr.:
- Revision:
- Date:
- Drawn By:
- Time:
- Reviewed By:
- Sheet
- of
- Size:
- A3
- Variant:
- File:

### Library data of the parts
BTN2-BTN100 = MX1A-E1NW: BTN CHERRY MX BLUE SPST-NO 12V 10mA; Mechanical Life: 20000000Cycles; Throw Configuration: SPST; Contact Resistance: 200mR; Operating Force: 0.5N; Switch Function: Off-Mom; Row Spacing: 2.54mm; Actuator Length: 3.6mm; Supplier 1: Digi-Key; Manufacturer: Cherry; Manufacturer Part Number: MX1A-E1NW; Stock 1: 3965; Pricing 1: 1 = 0,90000, 10 = 0,84000, 25 = 0,80000, 50 = 0,76000, 100 = 0,74000, 250 = 0,72000, 500 = 0,68000, 1000 = 0,64000, 5000 = 0,54000 (USD); RoHS: Yes; Mount: Through Hole; Contact Plating: Gold; Contact Material: Gold,Silver; Number of Terminals: 2; Housing Material: Thermoplastic; Min Operating Temperature: -10°C; Max Operating Temperature: 70°C; Voltage Rating (AC): 12V; Voltage Rating (DC): 12V; Packaging: Bulk; Current Rating: 10mA; Max Voltage Rating (AC): 12V; Max Voltage Rating (DC): 12V; Max Current Rating: 10mA; Package Quantity: 1000; Termination: PC Pin; Electrical Life: 20000000Cycles; Orientation: Straight; Contact Current Rating: 10mA; Length: 15.6mm; Terminal Pitch: 6.35mm; Width: 15.6mm; Lead Free: Lead Free; Flammability Rating: UL94 HB; ComponentLink1URL: https://datasheet.ciiva.com/2869/mx20series-2869568.pdf?src-supplier=Digi-Key; ComponentLink1Description: https://datasheet.ciiva.com/2869/mx20series-2869568.pdf?src-supplier=Digi-Key; ComponentLink2URL: https://datasheet.ciiva.com/5259/mx-cat-216303-5259204.pdf?src-supplier=Mouser; ComponentLink2Description: https://datasheet.ciiva.com/5259/mx-cat-216303-5259204.pdf?src-supplier=Mouser; Supplier Part Number 1: CH197-ND
  BTN19: Key Function: *
  BTN31: Key Function: ?
  BTN90: Key Function: -
D1-D99 = 1N4148W-TP: DIODE GEN-PURP 100V 150mA 1V25@150mA SMD SOD-23; Manufacturer: MCC; Max Surge Current: 2A; Forward Voltage: 1V; Recovery Time: 4ns; Max Reverse Leakage Current: 5uA; Power Dissipation: 400mW; Max Forward Surge Current (Ifsm): 1A; Element Configuration: Single; Polarity: Standard; Capacitance: 4pF; Supplier 1: Digi-Key; Manufacturer Part Number: 1N4148W-TP; Stock 1: 1077433; Pricing 1: 1 = 0,13000, 10 = 0,11900, 100 = 0,06480, 500 = 0,03986, 1000 = 0,02718 (USD); RoHS: Yes; Mount: Surface Mount; Number of Pins: 2; Min Operating Temperature: -65°C; Max Operating Temperature: 150°C; Packaging: Tape and Reel; Forward Current: 150mA; Package Quantity: 3000; Average Rectified Current: 150mA; Reverse Recovery Time: 4ns; Max Repetitive Reverse Voltage (Vrrm): 100V; Peak Non-Repetitive Surge Current: 2A; Voltage Rating (DC): 100V; Current Rating: 150mA; Output Current: 150mA; Max Reverse Voltage (DC): 100V; Length: 2.85mm; Height: 1.2mm; Width: 1.8mm; Radiation Hardening: No; REACH SVHC: Unknown; Lead Free: Lead Free; ComponentLink1URL: https://datasheet.ciiva.com/1243/1684829-1243908.pdf?src-supplier=Newark; ComponentLink1Description: https://datasheet.ciiva.com/1243/1684829-1243908.pdf?src-supplier=Newark; ComponentLink2URL: https://datasheet.ciiva.com/16836/1n4148wsod123-16836277.pdf?src-supplier=Future+Electronics; ComponentLink2Description: https://datasheet.ciiva.com/16836/1n4148wsod123-16836277.pdf?src-supplier=Future+Electronics; ComponentLink3URL: https://datasheet.ciiva.com/4435/1n4148wsod123-48460-4435223.pdf?src-supplier=Mouser; ComponentLink3Description: https://datasheet.ciiva.com/4435/1n4148wsod123-48460-4435223.pdf?src-supplier=Mouser; ComponentLink4URL: https://datasheet.ciiva.com/14557/70055519-14557767.pdf?src-supplier=Allied+Electronics; ComponentLink4Description: https://datasheet.ciiva.com/14557/70055519-14557767.pdf?src-supplier=Allied+Electronics; ComponentLink5URL: https://datasheet.ciiva.com/911/1n4148wsod123-911676.pdf?src-supplier=Digi-Key; ComponentLink5Description: https://datasheet.ciiva.com/911/1n4148wsod123-911676.pdf?src-supplier=Digi-Key; ComponentLink6URL: https://datasheet.ciiva.com/7622/1684829-7622556.pdf?src-supplier=Element14; ComponentLink6Description: https://datasheet.ciiva.com/7622/1684829-7622556.pdf?src-supplier=Element14; ComponentLink7URL: https://datasheet.ciiva.com/911/1n4148wsod123-911677.pdf?src-supplier=Digi-Key; ComponentLink7Description: https://datasheet.ciiva.com/911/1n4148wsod123-911677.pdf?src-supplier=Digi-Key; ComponentLink8URL: https://datasheet.ciiva.com/911/1n4148wsod123-911678.pdf?src-supplier=Digi-Key; ComponentLink8Description: https://datasheet.ciiva.com/911/1n4148wsod123-911678.pdf?src-supplier=Digi-Key; ComponentLink9URL: https://datasheet.ciiva.com/22747/1684829-22747439.pdf?src-supplier=Element14; ComponentLink9Description: https://datasheet.ciiva.com/22747/1684829-22747439.pdf?src-supplier=Element14; Supplier Part Number 1: 1N4148WTPMSCT-ND
R3-R18 = RC0402FR-0710KL: RES 10K 1% 1/16W SMD 0402 YAEGO; Manufacturer: Yageo; Voltage Rating: 50V; Manufacturer Part Number: RC0402FR-0710KL; RoHS: Yes; Case/Package: 0402; Number of Pins: 2; Case Code (Metric): 1005; Min Operating Temperature: -55°C; Max Operating Temperature: 155°C; Packaging: Tape and Reel; Composition: Thick Film; Voltage Rating (DC): 50V; Termination: SMD/SMT; Military Standard: Not; Working Voltage: 50V; Number of Terminations: 2; Length: 1mm; Height: 0.32mm; Width: 0.5mm; Depth: 0.5mm; Lead Pitch: 0.2mm; REACH SVHC: No SVHC; Lead Free: Lead Free; ComponentLink1URL: https://datasheet.ciiva.com/7660/38568-7660787.pdf?src-supplier=Element14; ComponentLink1Description: https://datasheet.ciiva.com/7660/38568-7660787.pdf?src-supplier=Element14; ComponentLink2URL: https://datasheet.ciiva.com/7849/1784430-7849813.pdf?src-supplier=Element14; ComponentLink2Description: https://datasheet.ciiva.com/7849/1784430-7849813.pdf?src-supplier=Element14; ComponentLink3URL: https://datasheet.ciiva.com/7849/1686128-7849814.pdf?src-supplier=Element14; ComponentLink3Description: https://datasheet.ciiva.com/7849/1686128-7849814.pdf?src-supplier=Element14; ComponentLink4URL: https://datasheet.ciiva.com/7849/1784430-7849815.pdf?src-supplier=Element14; ComponentLink4Description: https://datasheet.ciiva.com/7849/1784430-7849815.pdf?src-supplier=Element14; ComponentLink5URL: https://datasheet.ciiva.com/22747/1018594-22747512.pdf?src-supplier=Element14; ComponentLink5Description: https://datasheet.ciiva.com/22747/1018594-22747512.pdf?src-supplier=Element14; ComponentLink6URL: https://datasheet.ciiva.com/12667/pyu-rc0402-51-rohs-l-6-r-12667067.pdf?src-supplier=Mouser; ComponentLink6Description: https://datasheet.ciiva.com/12667/pyu-rc0402-51-rohs-l-6-r-12667067.pdf?src-supplier=Mouser; ComponentLink7URL: https://datasheet.ciiva.com/7983/1018594-7983486.pdf?src-supplier=Element14; ComponentLink7Description: https://datasheet.ciiva.com/7983/1018594-7983486.pdf?src-supplier=Element14; Package Quantity: 10000; ComponentLink8URL: https://datasheet.ciiva.com/11819/0900766b80c66297-11819487.pdf?src-supplier=RSComponents; ComponentLink8Description: https://datasheet.ciiva.com/11819/0900766b80c66297-11819487.pdf?src-supplier=RSComponents; ComponentLink9URL: https://datasheet.ciiva.com/15189/getdatasheetpartid-329253-15189431.pdf?src-supplier=Verical; ComponentLink9Description: https://datasheet.ciiva.com/15189/getdatasheetpartid-329253-15189431.pdf?src-supplier=Verical; ComponentLink10URL: https://datasheet.ciiva.com/24070/pyu-rc0402-51-rohs-l-6-r-8721-24070077.pdf?src-supplier=Mouser; ComponentLink10Description: https://datasheet.ciiva.com/24070/pyu-rc0402-51-rohs-l-6-r-8721-24070077.pdf?src-supplier=Mouser; ComponentLink11URL: https://datasheet.ciiva.com/7849/1018594-7849966.pdf?src-supplier=Element14; ComponentLink11Description: https://datasheet.ciiva.com/7849/1018594-7849966.pdf?src-supplier=Element14; ComponentLink12URL: https://datasheet.ciiva.com/7849/1018594-7849967.pdf?src-supplier=Element14; ComponentLink12Description: https://datasheet.ciiva.com/7849/1018594-7849967.pdf?src-supplier=Element14; ComponentLink13URL: https://datasheet.ciiva.com/17070/pyu-rc0402-51-rohs-l-6-r-17070335.pdf?src-supplier=Future+Electronics; ComponentLink13Description: https://datasheet.ciiva.com/17070/pyu-rc0402-51-rohs-l-6-r-17070335.pdf?src-supplier=Future+Electronics; Supplier 1: Digi-Key; Stock 1: 86154015; Pricing 1: 1 = 0,10000, 10 = 0,01600, 100 = 0,00670, 1000 = 0,00301, 2500 = 0,00261, 5000 = 0,00215 (USD); Supplier Part Number 1: 311-10.0KLRCT-ND
R19-R25 = RC0402FR-071K5L: RES 1K5 1% 1/16W SMD 0402 YAEGO; Manufacturer: Yageo; Voltage Rating: 50V; Supplier 1: Digi-Key; Manufacturer Part Number: RC0402FR-071K5L; Stock 1: 9091318; Pricing 1: 1 = 0,10000, 10 = 0,01600, 100 = 0,00640, 1000 = 0,00286, 2500 = 0,00248, 5000 = 0,00205 (USD); RoHS: Yes; Case Code (Metric): 1005; Case Code (Imperial): 0402; Min Operating Temperature: -55°C; Max Operating Temperature: 155°C; Package Quantity: 1; Power Rating: 62.5mW; Packaging: Tape and Reel; Composition: Thick Film; Number of Terminations: 2; Termination: SMD/SMT; Military Standard: Not; Features: Moisture Resistant; Length: 1mm; Height: 0.016inch; Width: 0.02inch; Depth: 0.5mm; REACH SVHC: No SVHC; Lead Free: Lead Free; ComponentLink1URL: https://datasheet.ciiva.com/11808/0900766b80c66297-11808238.pdf?src-supplier=RSComponents; ComponentLink1Description: https://datasheet.ciiva.com/11808/0900766b80c66297-11808238.pdf?src-supplier=RSComponents; ComponentLink2URL: https://datasheet.ciiva.com/2453/pyu-r-int-thick-7-2453440.pdf?src-supplier=Digi-Key; ComponentLink2Description: https://datasheet.ciiva.com/2453/pyu-r-int-thick-7-2453440.pdf?src-supplier=Digi-Key; ComponentLink3URL: https://datasheet.ciiva.com/2453/pyu-r-int-thick-7-2453441.pdf?src-supplier=Digi-Key; ComponentLink3Description: https://datasheet.ciiva.com/2453/pyu-r-int-thick-7-2453441.pdf?src-supplier=Digi-Key; ComponentLink4URL: https://datasheet.ciiva.com/46394/1018594-46394950.pdf?src-supplier=Element14; ComponentLink4Description: https://datasheet.ciiva.com/46394/1018594-46394950.pdf?src-supplier=Element14; ComponentLink5URL: https://datasheet.ciiva.com/7849/1018594-7849864.pdf?src-supplier=Element14; ComponentLink5Description: https://datasheet.ciiva.com/7849/1018594-7849864.pdf?src-supplier=Element14; ComponentLink6URL: https://datasheet.ciiva.com/15189/getdatasheetpartid-323992-15189370.pdf?src-supplier=Verical; ComponentLink6Description: https://datasheet.ciiva.com/15189/getdatasheetpartid-323992-15189370.pdf?src-supplier=Verical; ComponentLink7URL: https://datasheet.ciiva.com/7849/1018594-7849863.pdf?src-supplier=Element14; ComponentLink7Description: https://datasheet.ciiva.com/7849/1018594-7849863.pdf?src-supplier=Element14; ComponentLink8URL: https://datasheet.ciiva.com/12558/pyu-rc0402-51-rohs-l-6-r-8721-12558542.pdf?src-supplier=Mouser; ComponentLink8Description: https://datasheet.ciiva.com/12558/pyu-rc0402-51-rohs-l-6-r-8721-12558542.pdf?src-supplier=Mouser; ComponentLink9URL: https://datasheet.ciiva.com/2453/pyu-r-int-thick-7-2453439.pdf?src-supplier=Digi-Key; ComponentLink9Description: https://datasheet.ciiva.com/2453/pyu-r-int-thick-7-2453439.pdf?src-supplier=Digi-Key; Supplier Part Number 1: 311-1.50KLRCT-ND